# Altium schematic sheet Snowflake.SchDoc: Template
size A4; Author: Hom; CompanyName: KitSprout; DrawnBy: Hom; Engineer: Hom; Organization: KitSprout; Revision: A; SheetNumber: 2; SheetTotal: 1; Version: 0.0; LibVersion: 0.0
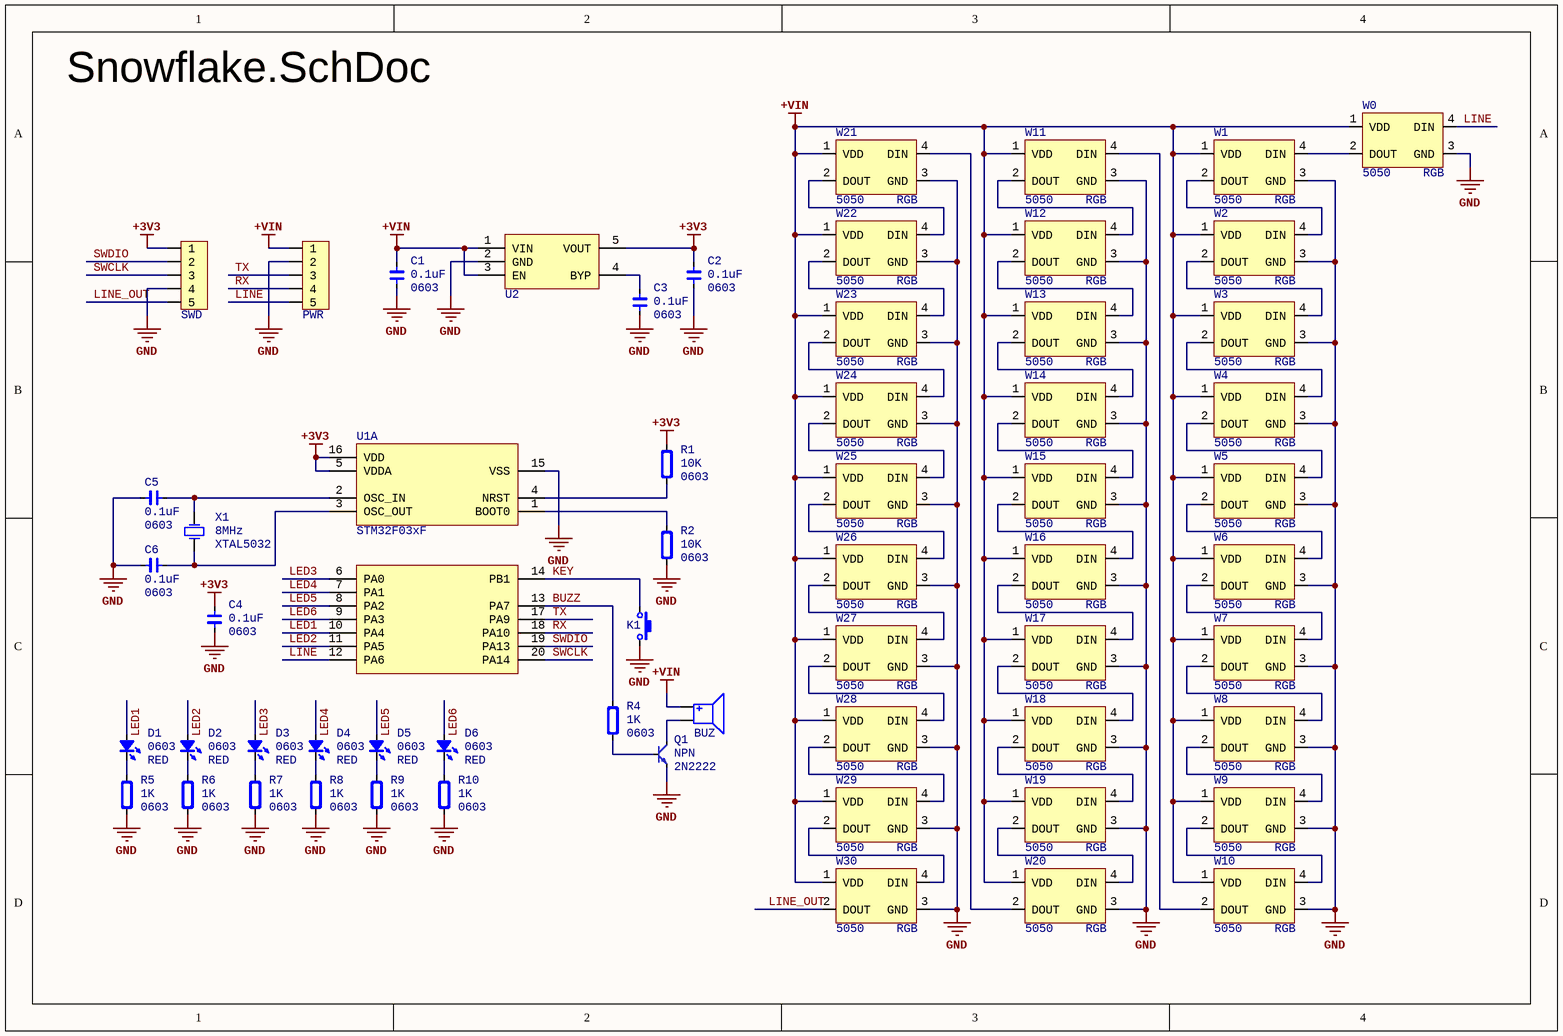
[diagram p0: Snowflake.SchDoc]

## Parts
BUZ  Buzzer  [Buzzer_5x5]  (value not drawn)
C1  Type: 0603  [CAP_0603]  (hidden comment: 0.1uF)
C2  Type: 0603  [CAP_0603]  (hidden comment: 0.1uF)
C3  Type: 0603  [CAP_0603]  (hidden comment: 0.1uF)
C4  Type: 0603  [CAP_0603]  (hidden comment: 0.1uF)
C5  Type: 0603  [CAP_0603]  (hidden comment: 0.1uF)
C6  Type: 0603  [CAP_0603]  (hidden comment: 0.1uF)
D1  Type: 0603  [LED_0603_RED]  (hidden comment: RED)
D2  Type: 0603  [LED_0603_RED]  (hidden comment: RED)
D3  Type: 0603  [LED_0603_RED]  (hidden comment: RED)
D4  Type: 0603  [LED_0603_RED]  (hidden comment: RED)
D5  Type: 0603  [LED_0603_RED]  (hidden comment: RED)
D6  Type: 0603  [LED_0603_RED]  (hidden comment: RED)
K1  ButtonTACT  [ButtonTACT_3x4x2_180]  (value not drawn)
PWR  HDR1x5_2.54  [HDR1X5_2.54_180]  (value not drawn)
Q1  Type: 2N2222  [SOT23-3]  (hidden comment: NPN)
R1  Type: 0603  [RES_0603]  (hidden comment: 10K)
R2  Type: 0603  [RES_0603]  (hidden comment: 10K)
R4  Type: 0603  [RES_0603]  (hidden comment: 1K)
R5  Type: 0603  [RES_0603]  (hidden comment: 1K)
R6  Type: 0603  [RES_0603]  (hidden comment: 1K)
R7  Type: 0603  [RES_0603]  (hidden comment: 1K)
R8  Type: 0603  [RES_0603]  (hidden comment: 1K)
R9  Type: 0603  [RES_0603]  (hidden comment: 1K)
R10  Type: 0603  [RES_0603]  (hidden comment: 1K)
SWD  HDR1x5_2.54  [HDR1X5_2.54_180]  (value not drawn)
U1  STM32F03xF  [TSSOP_E170_P0.65_20]  (parts A,B of 2)
U2  RT9193  [SOT23-5]  (value not drawn)
W0  Type: 5050  [LED_5050_WS2812B]  (hidden comment: RGB)
W1  Type: 5050  [LED_5050_WS2812B]  (hidden comment: RGB)
W2  Type: 5050  [LED_5050_WS2812B]  (hidden comment: RGB)
W3  Type: 5050  [LED_5050_WS2812B]  (hidden comment: RGB)
W4  Type: 5050  [LED_5050_WS2812B]  (hidden comment: RGB)
W5  Type: 5050  [LED_5050_WS2812B]  (hidden comment: RGB)
W6  Type: 5050  [LED_5050_WS2812B]  (hidden comment: RGB)
W7  Type: 5050  [LED_5050_WS2812B]  (hidden comment: RGB)
W8  Type: 5050  [LED_5050_WS2812B]  (hidden comment: RGB)
W9  Type: 5050  [LED_5050_WS2812B]  (hidden comment: RGB)
W10  Type: 5050  [LED_5050_WS2812B]  (hidden comment: RGB)
W11  Type: 5050  [LED_5050_WS2812B]  (hidden comment: RGB)
W12  Type: 5050  [LED_5050_WS2812B]  (hidden comment: RGB)
W13  Type: 5050  [LED_5050_WS2812B]  (hidden comment: RGB)
W14  Type: 5050  [LED_5050_WS2812B]  (hidden comment: RGB)
W15  Type: 5050  [LED_5050_WS2812B]  (hidden comment: RGB)
W16  Type: 5050  [LED_5050_WS2812B]  (hidden comment: RGB)
W17  Type: 5050  [LED_5050_WS2812B]  (hidden comment: RGB)
W18  Type: 5050  [LED_5050_WS2812B]  (hidden comment: RGB)
W19  Type: 5050  [LED_5050_WS2812B]  (hidden comment: RGB)
W20  Type: 5050  [LED_5050_WS2812B]  (hidden comment: RGB)
W21  Type: 5050  [LED_5050_WS2812B]  (hidden comment: RGB)
W22  Type: 5050  [LED_5050_WS2812B]  (hidden comment: RGB)
W23  Type: 5050  [LED_5050_WS2812B]  (hidden comment: RGB)
W24  Type: 5050  [LED_5050_WS2812B]  (hidden comment: RGB)
W25  Type: 5050  [LED_5050_WS2812B]  (hidden comment: RGB)
W26  Type: 5050  [LED_5050_WS2812B]  (hidden comment: RGB)
W27  Type: 5050  [LED_5050_WS2812B]  (hidden comment: RGB)
W28  Type: 5050  [LED_5050_WS2812B]  (hidden comment: RGB)
W29  Type: 5050  [LED_5050_WS2812B]  (hidden comment: RGB)
W30  Type: 5050  [LED_5050_WS2812B]  (hidden comment: RGB)
X1  Type: XTAL5032  [XT_5032_2]  (hidden comment: 8MHz)

## Nets
+3V3: C2.2 C4.2 R1.2 SWD.1 U1.5(VDDA) U1.16(VDD) U2.5(VOUT)
+VIN: BUZ.P(Positive) C1.2 PWR.1 U2.1(VIN) U2.3(EN) W0.1(VDD) W1.1(VDD) W2.1(VDD) W3.1(VDD) W4.1(VDD) W5.1(VDD) W6.1(VDD) W7.1(VDD) W8.1(VDD) W9.1(VDD) W10.1(VDD) W11.1(VDD) W12.1(VDD) W13.1(VDD) W14.1(VDD) W15.1(VDD) W16.1(VDD) W17.1(VDD) W18.1(VDD) W19.1(VDD) W20.1(VDD) W21.1(VDD) W22.1(VDD) W23.1(VDD) W24.1(VDD) W25.1(VDD) W26.1(VDD) W27.1(VDD) W28.1(VDD) W29.1(VDD) W30.1(VDD)
GND: C1.1 C2.1 C3.1 C4.1 C5.1 C6.1 K1.2 PWR.2 Q1.2(E) R2.1 R5.1 R6.1 R7.1 R8.1 R9.1 R10.1 SWD.4 U1.15(VSS) U2.2(GND) W0.3(GND) W1.3(GND) W2.3(GND) W3.3(GND) W4.3(GND) W5.3(GND) W6.3(GND) W7.3(GND) W8.3(GND) W9.3(GND) W10.3(GND) W11.3(GND) W12.3(GND) W13.3(GND) W14.3(GND) W15.3(GND) W16.3(GND) W17.3(GND) W18.3(GND) W19.3(GND) W20.3(GND) W21.3(GND) W22.3(GND) W23.3(GND) W24.3(GND) W25.3(GND) W26.3(GND) W27.3(GND) W28.3(GND) W29.3(GND) W30.3(GND)
BUZZ: R4.1 U1.13(PA7)
KEY: K1.1 U1.14(PB1)
LED1: D1.1(A) U1.10(PA4)
LED2: D2.1(A) U1.11(PA5)
LED3: D3.1(A) U1.6(PA0)
LED4: D4.1(A) U1.7(PA1)
LED5: D5.1(A) U1.8(PA2)
LED6: D6.1(A) U1.9(PA3)
LINE: PWR.5 U1.12(PA6) W0.4(DIN)
LINE_OUT: SWD.5 W30.2(DOUT)
RX: PWR.4 U1.18(PA10)
SWCLK: SWD.3 U1.20(PA14)
SWDIO: SWD.2 U1.19(PA13)
TX: PWR.3 U1.17(PA9)
NetBUZ_N: BUZ.N(Negative) Q1.3(C)
NetC3_2: C3.2 U2.4(BYP)
NetC5_2: C5.2 U1.2(OSC_IN) X1.2(OSC2)
NetC6_2: C6.2 U1.3(OSC_OUT) X1.1(OSC1)
NetD1_2: D1.2(K) R5.2
NetD2_2: D2.2(K) R6.2
NetD3_2: D3.2(K) R7.2
NetD4_2: D4.2(K) R8.2
NetD5_2: D5.2(K) R9.2
NetD6_2: D6.2(K) R10.2
NetQ1_1: Q1.1(B) R4.2
NetR1_1: R1.1 U1.4(NRST)
NetR2_2: R2.2 U1.1(BOOT0)
NetW0_2: W0.2(DOUT) W1.4(DIN)
NetW1_2: W1.2(DOUT) W2.4(DIN)
NetW2_2: W2.2(DOUT) W3.4(DIN)
NetW3_2: W3.2(DOUT) W4.4(DIN)
NetW4_2: W4.2(DOUT) W5.4(DIN)
NetW5_2: W5.2(DOUT) W6.4(DIN)
NetW6_2: W6.2(DOUT) W7.4(DIN)
NetW7_2: W7.2(DOUT) W8.4(DIN)
NetW8_2: W8.2(DOUT) W9.4(DIN)
NetW9_2: W9.2(DOUT) W10.4(DIN)
NetW10_2: W10.2(DOUT) W11.4(DIN)
NetW11_2: W11.2(DOUT) W12.4(DIN)
NetW12_2: W12.2(DOUT) W13.4(DIN)
NetW13_2: W13.2(DOUT) W14.4(DIN)
NetW14_2: W14.2(DOUT) W15.4(DIN)
NetW15_2: W15.2(DOUT) W16.4(DIN)
NetW16_2: W16.2(DOUT) W17.4(DIN)
NetW17_2: W17.2(DOUT) W18.4(DIN)
NetW18_2: W18.2(DOUT) W19.4(DIN)
NetW19_2: W19.2(DOUT) W20.4(DIN)
NetW20_2: W20.2(DOUT) W21.4(DIN)
NetW21_2: W21.2(DOUT) W22.4(DIN)
NetW22_2: W22.2(DOUT) W23.4(DIN)
NetW23_2: W23.2(DOUT) W24.4(DIN)
NetW24_2: W24.2(DOUT) W25.4(DIN)
NetW25_2: W25.2(DOUT) W26.4(DIN)
NetW26_2: W26.2(DOUT) W27.4(DIN)
NetW27_2: W27.2(DOUT) W28.4(DIN)
NetW28_2: W28.2(DOUT) W29.4(DIN)
NetW29_2: W29.2(DOUT) W30.4(DIN)

## Library data of the parts
C1-C6 = Cap_0603: Capacitor; Value: 0.1uF
D1-D6 = LED_0603: LED; Value: RED
K1 = ButtonTACT_3x4x2_180: Button; Value: ButtonTACT
PWR SWD = HDR1x5_2.54: Header
Q1 = BJT_NPN: Transistor; Value: NPN
R1 R2 R4-R10 = Res_0603: Resistor
  R1 R2: Value: 10K
  R4-R10: Value: 1K
U1 = STM32F03xF: MCU
U2 = RT9193: Power; Type: SOT23-5
W0-W30 = LED_5050_WS2812B: LED; Value: RGB
X1 = XTAL_5032_2P: Crystal Oscillator; Value: 8MHz